# Altium project mbed_board.PrjPCB
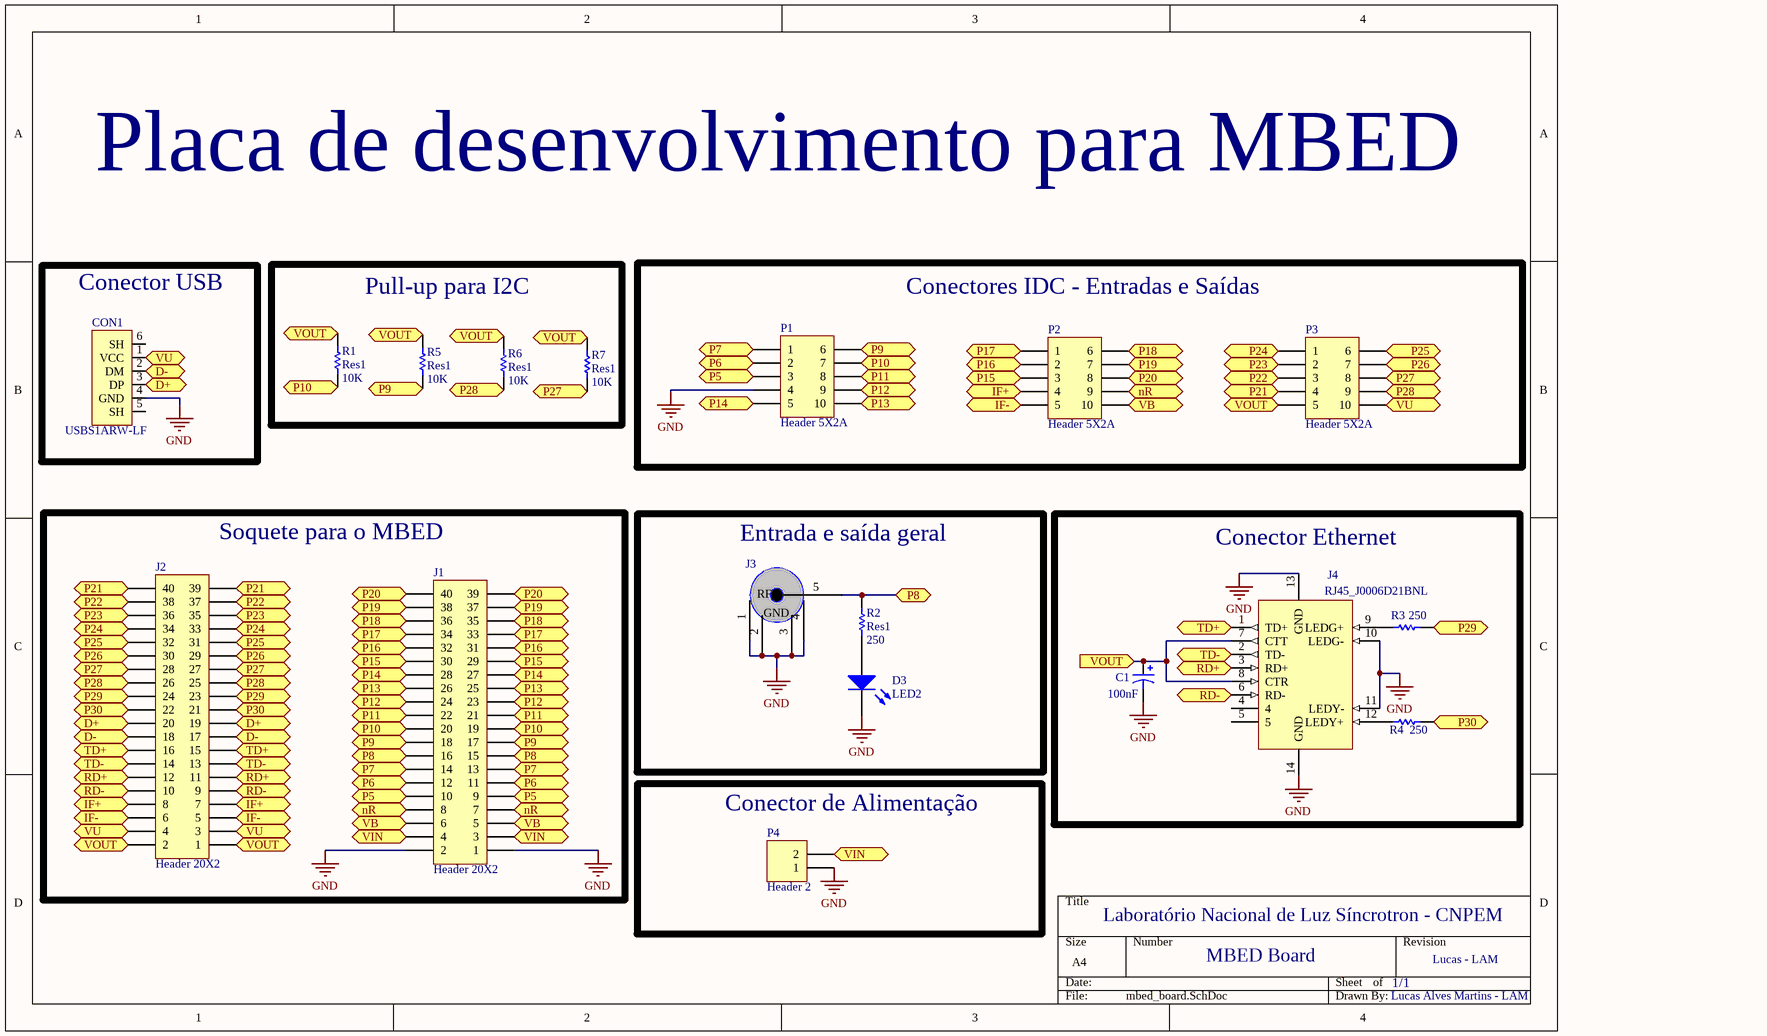
[diagram p0: mbed_board.SchDoc]
1 sheet, 18 parts. Net scope: flat (ports and power ports of the same name join across sheets).
Board file: mbed_board.PcbDoc

## Sheet mbed_board.SchDoc
size A4

### Parts
C1  value 100nF  [C1206]  (hidden comment: Cap Pol3)
CON1  USBS1ARW-LF  [USB_CON_A]
D3  LED2  [3.2X1.6X1.1]
J1  Header 20X2  [HDR2X20]
J2  Header 20X2  [HDR2X20]
J3  CONN SMA  [SMA]  (value not drawn)
J4  RJ45_J0006D21BNL  [RJ45_J0006D21BNL]
P1  Header 5X2A  [HDR2X5_CEN]
P2  Header 5X2A  [HDR2X5_CEN]
P3  Header 5X2A  [HDR2X5_CEN]
P4  Header 2  [HDR1X2]
R1  Res1  value 10K  [6-0805_M]
R2  Res1  value 250  [6-0805_M]
R3  value 250  [6-0805_M]  (hidden comment: Res1)
R4  value 250  [6-0805_M]  (hidden comment: Res1)
R5  Res1  value 10K  [6-0805_M]
R6  Res1  value 10K  [6-0805_M]
R7  Res1  value 10K  [6-0805_M]

### Blocks framed on the sheet
Conector USB: CON1
Pull-up para I2C: R1 R5-R7
Conectores IDC - Entradas e Saídas: P1-P3
Soquete para o MBED: J1 J2
Entrada e saída geral: D3 J3 R2
Conector Ethernet: C1 J4 R3 R4
Conector de Alimentação: P4

### Ports
D+, D+ (bidir), D-, D- (bidir), IF+, IF-, nR, P5, P6, P7, P8, P8 (bidir), P9, P10, P11, P12, P13, P14, P15, P16, P17, P18, P19, P20, P21, P22, P23, P24, P25, P26, P27, P28, P29, P30, RD+, RD-, TD+, TD-, VB, VIN, VIN (out), VOUT, VOUT (in), VU, VU (in)

### Nets
GND: C1.2 CON1.4(GND) D3.2(K) J1.1 J1.2 J3.1(GND) J3.2(GND) J3.3(GND) J3.4(GND) J4.10(LEDG-) J4.11(LEDY-) J4.13(GND) J4.14(GND) P1.4 P4.1
NetC1_1: C1.1 J2.1 J2.2 J4.7(CTT) J4.8(CTR) P3.5 R1.1 R5.1 R6.1 R7.1 ; port VOUT
NetCON1_1: CON1.1(VCC) J2.3 J2.4 P3.10 ; port VU
NetCON1_2: CON1.2(DM) J2.17 J2.18 ; port D-
NetCON1_3: CON1.3(DP) J2.19 J2.20 ; port D+
NetD3_1: D3.1(A) R2.2
NetJ1_3: J1.3 J1.4 P4.2 ; port VIN
NetJ1_5: J1.5 J1.6 P2.10 ; port VB
NetJ1_7: J1.7 J1.8 P2.9 ; port nR
NetJ1_9: J1.9 J1.10 P1.3 ; port P5
NetJ1_11: J1.11 J1.12 P1.2 ; port P6
NetJ1_13: J1.13 J1.14 P1.1 ; port P7
NetJ1_15: J1.15 J1.16 J3.5(RFin) R2.1 ; port P8
NetJ1_17: J1.17 J1.18 P1.6 R5.2 ; port P9
NetJ1_19: J1.19 J1.20 P1.7 R1.2 ; port P10
NetJ1_21: J1.21 J1.22 P1.8 ; port P11
NetJ1_23: J1.23 J1.24 P1.9 ; port P12
NetJ1_25: J1.25 J1.26 P1.10 ; port P13
NetJ1_27: J1.27 J1.28 P1.5 ; port P14
NetJ1_29: J1.29 J1.30 P2.3 ; port P15
NetJ1_31: J1.31 J1.32 P2.2 ; port P16
NetJ1_33: J1.33 J1.34 P2.1 ; port P17
NetJ1_35: J1.35 J1.36 P2.6 ; port P18
NetJ1_37: J1.37 J1.38 P2.7 ; port P19
NetJ1_39: J1.39 J1.40 P2.8 ; port P20
NetJ2_5: J2.5 J2.6 P2.5 ; port IF-
NetJ2_7: J2.7 J2.8 P2.4 ; port IF+
NetJ2_9: J2.9 J2.10 J4.6(RD-) ; port RD-
NetJ2_11: J2.11 J2.12 J4.3(RD+) ; port RD+
NetJ2_13: J2.13 J2.14 J4.2(TD-) ; port TD-
NetJ2_15: J2.15 J2.16 J4.1(TD+) ; port TD+
NetJ2_21: J2.21 J2.22 R4.1 ; port P30
NetJ2_23: J2.23 J2.24 R3.1 ; port P29
NetJ2_25: J2.25 J2.26 P3.9 R6.2 ; port P28
NetJ2_27: J2.27 J2.28 P3.8 R7.2 ; port P27
NetJ2_29: J2.29 J2.30 P3.7 ; port P26
NetJ2_31: J2.31 J2.32 P3.6 ; port P25
NetJ2_33: J2.33 J2.34 P3.1 ; port P24
NetJ2_35: J2.35 J2.36 P3.2 ; port P23
NetJ2_37: J2.37 J2.38 P3.3 ; port P22
NetJ2_39: J2.39 J2.40 P3.4 ; port P21
NetJ4_9: J4.9(LEDG+) R3.2
NetJ4_12: J4.12(LEDY+) R4.2

Not connected (* = marked no-connect by the designer): CON1 5(SH) 6(SH); J4 4 5

### Notes on the sheet
- Placa de desenvolvimento para MBED
- Laboratório Nacional de Luz Síncrotron - CNPEM
- MBED Board
- 1/1
- Lucas - LAM
- Lucas Alves Martins - LAM
- (in symbol SMA) RF

### Library data of the parts
C1 = Cap Pol3: Polarized Capacitor (Surface Mount); Published: 8-Jun-2000; LatestRevisionDate: 29-May-2009; LatestRevisionNote: IPC-7351 Footprint Added.; PackageReference: C0805; Publisher: Altium Limited; PackageDescription: Chip Capacitor
CON1 = CON_USB_A: USB connector A type (Maritex)
D3 = LED2: Typical RED, GREEN, YELLOW, AMBER GaAs LED; Published: 8-Jun-2000; LatestRevisionDate: 17-Jul-2002; LatestRevisionNote: Re-released for DXP Platform.; PackageVersion: Feb-2002; PackageReference: 3.2X1.6X1.1; Publisher: Altium Limited; PackageDescription: SM LED; 2 Flat Leads
J1 J2 = Header 20X2: Header, 20-Pin, Dual row; LatestRevisionDate: 17-Jul-2002; LatestRevisionNote: Re-released for DXP Platform.; Publisher: Altium Limited
J3 = SMA: Connector; RF Coaxial, MCX, Thru-Hole; 5 Position; Right-Angle
J4 = RJ45_J0006D21BNL: Connector Ethernet RJ45_J0006D21BNL
P1-P3 = Header 5X2A: Header, 5-Pin, Dual row; LatestRevisionDate: 17-Jul-2002; LatestRevisionNote: Re-released for DXP Platform.; Publisher: Altium Limited
P4 = Header 2: Header, 2-Pin; LatestRevisionDate: 17-Jul-2002; LatestRevisionNote: Re-released for DXP Platform.; Publisher: Altium Limited
R1-R7 = Res1: Resistor; Published: 8-Jun-2000; LatestRevisionDate: 17-Jul-2002; LatestRevisionNote: Re-released for DXP Platform.; PackageReference: AXIAL-0.3; Publisher: Altium Limited; PackageDescription: Axial Device, Thru-Hole; 2 Leads; 0.3 in Pin Spacing